# Altium project PCB_Project.PrjPcb
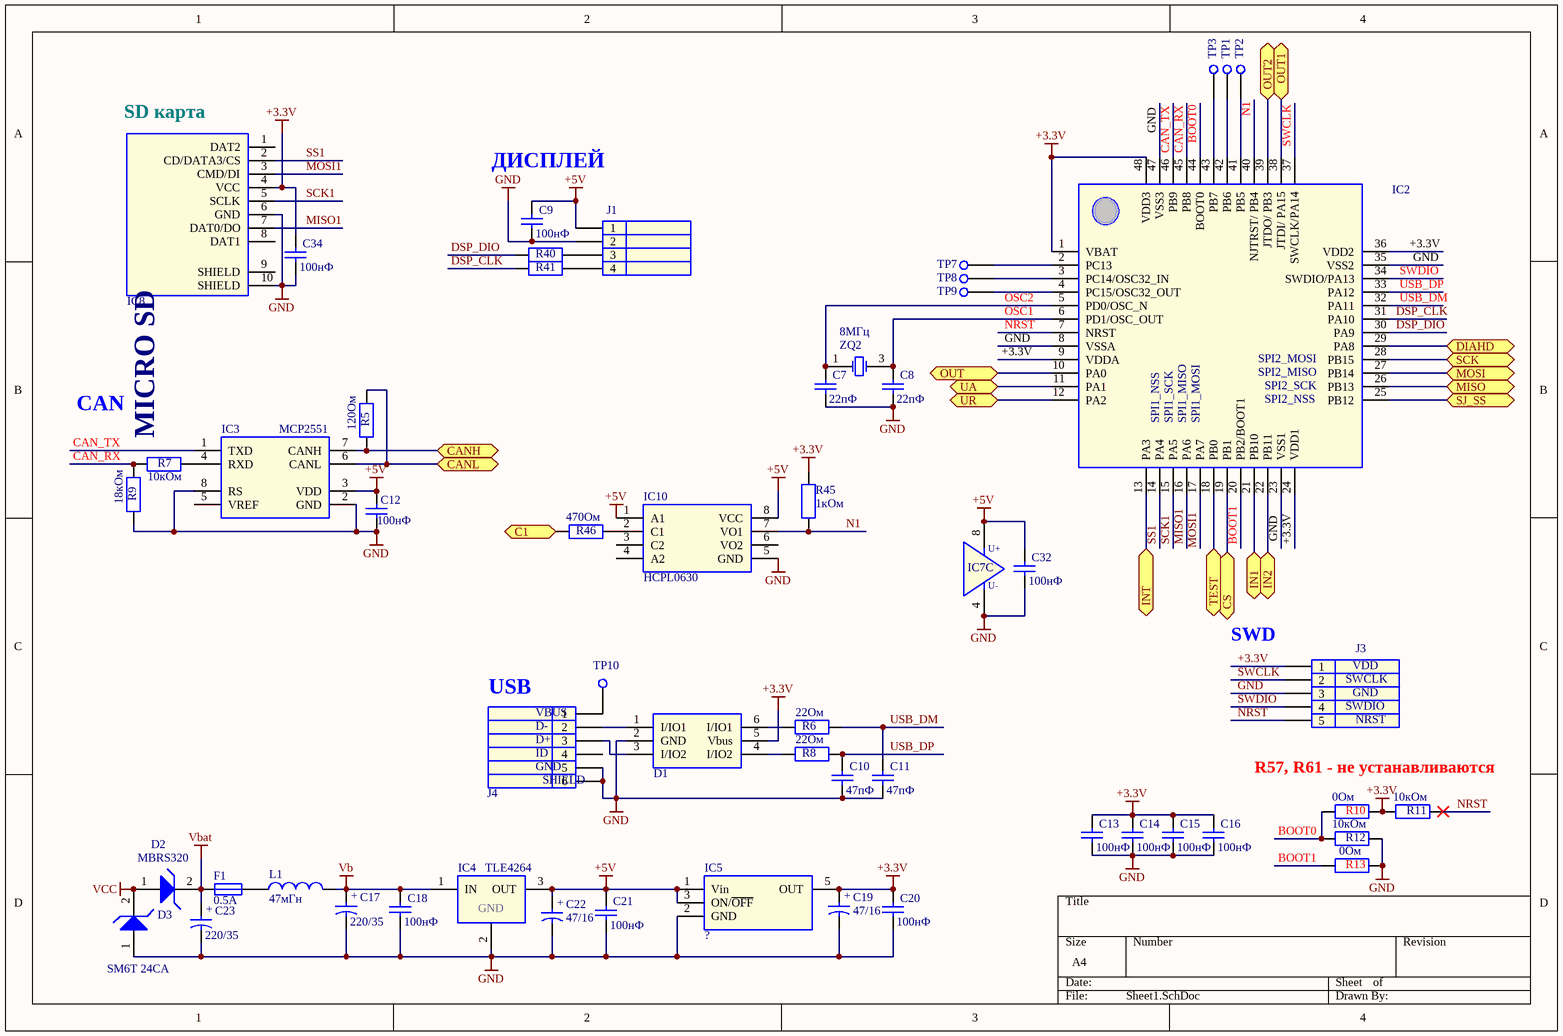
[diagram p0: Sheet1.SchDoc]
2 sheets, 112 parts. Net scope: flat (ports and power ports of the same name join across sheets).
Board file: PCB1.PcbDoc
Sheets:
  Sheet1.SchDoc
  Sheet2.SchDoc

## Sheet Sheet1.SchDoc
size A4

### Parts
C7  value 22пФ  [0603]  (hidden comment: Cap)
C8  value 22пФ  [0603]  (hidden comment: Cap)
C9  value 100нФ  [0603]  (hidden comment: Cap)
C10  value 47пФ  [0603]  (hidden comment: Cap)
C11  value 47пФ  [0603]  (hidden comment: Cap)
C12  value 100нФ  [0603]  (hidden comment: Cap)
C13  value 100нФ  [0603]  (hidden comment: Cap)
C14  value 100нФ  [0603]  (hidden comment: Cap)
C15  value 100нФ  [0603]  (hidden comment: Cap)
C16  value 100нФ  [0603]  (hidden comment: Cap)
C17  value 220/35  [SMD 8x10.5]  (hidden comment: Cap2)
C18  value 100нФ  [0603]  (hidden comment: Cap)
C19  value 47/16  [SMD 6.3x5.4]  (hidden comment: Cap2)
C20  value 100нФ  [0603]  (hidden comment: Cap)
C21  value 100нФ  [0603]  (hidden comment: Cap)
C22  value 47/16  [SMD 6.3x5.4]  (hidden comment: Cap2)
C23  value 220/35  [SMD 8x10.5]  (hidden comment: Cap2)
C32  value 100нФ  [0603]  (hidden comment: Cap)
C34  value 100нФ  [0603]  (hidden comment: Cap)
D1  USBLC6-2  [SOT23-6]  (value not drawn)
D2  value MBRS320  [DO-214AB]  (hidden comment: ZENER)
D3  value SM6T 24CA  [DO-214AA]  (hidden comment: ZENER)
F1  value 0.5A  [1812Fuse]  (hidden comment: FUSE)
IC2  STM32F10x_LQFP48  [LQFP48-0.5]  (value not drawn)
IC3  MCP2551  [SO-8]
IC4  value TLE4264  [SOT223]  (hidden comment: SOT223)
IC5  LP2980  [SOT23-5]  (value not drawn)
IC7  LM258  [SO-8]  (value not drawn)  (part C of 3)
IC8  MICRO_SD_SLOT  [MICRO SD CARD 2]  (value not drawn)
IC10  HCPL0630  [SO-8]
J1  s-4  [CWF-4R]  (value not drawn)
J3  s-5  [PLS-5]  (value not drawn)
J4  USB micro-BF  [USB micro B]  (value not drawn)
L1  value 47мГн  [LQH32C]  (hidden comment: Inductor)
R5  value 120Ом  [0603]  (hidden comment: Res)
R6  value 22Ом  [0603]  (hidden comment: Res)
R7  value 10кОм  [0603]  (hidden comment: Res)
R8  value 22Ом  [0603]  (hidden comment: Res)
R9  value 18кОм  [0603]  (hidden comment: Res)
R10  value 0Ом  [0603]  (hidden comment: Res)
R11  value 10кОм  [0603]  (hidden comment: Res)
R12  value 10кОм  [0603]  (hidden comment: Res)
R13  value 0Ом  [0603]  (hidden comment: Res)
R40  Res  [0603]  (value not drawn)
R41  Res  [0603]  (value not drawn)
R45  value 1кОм  [0603]  (hidden comment: Res)
R46  value 470Ом  [0603]  (hidden comment: Res)
TP1  TP  [PAD_R1]  (value not drawn)
TP2  TP  [PAD_R1]  (value not drawn)
TP3  TP  [PAD_R1]  (value not drawn)
TP7  TP  [PAD_R1]  (value not drawn)
TP8  TP  [PAD_R1]  (value not drawn)
TP9  TP  [PAD_R1]  (value not drawn)
TP10  TP  [PAD_R1]  (value not drawn)
ZQ2  value 8МГц  [KX-9A]  (hidden comment: QUARTZ_2)

### Ports
C1, CANH, CANL, CS, DIAHD, IN1, IN2, INT, MISO, MOSI, OUT, OUT1, OUT2, SCK, SJ_SS, TEST, UA, UR

### Nets
+3.3V: C13.2 C14.2 C15.2 C16.2 C19.1 C20.2 C34.2 D1.5(Vbus) IC2.1(VBAT) IC2.9(VDDA) IC2.24(VDD1) IC2.36(VDD2) IC2.48(VDD3) IC5.5(OUT) IC8.4(VCC) J3.1 R10.2 R11.1 R45.1
+5V: C9.2 C12.2 C21.2 C22.1 C32.2 IC3.3(VDD) IC4.3(OUT) IC5.1(Vin) IC5.3(ON/~{OFF}) IC7.8(+U) IC10.1(A1) IC10.8(VCC) J1.1
GND: C7.1 C8.1 C9.1 C10.1 C11.1 C12.1 C13.1 C14.1 C15.1 C16.1 C17.2 C18.1 C19.2 C20.1 C21.1 C22.2 C23.2 C32.1 C34.1 D1.2(GND) D3.1(A) IC2.8(VSSA) IC2.23(VSS1) IC2.35(VSS2) IC2.47(VSS3) IC3.2(GND) IC3.8(RS) IC4.2(GND) IC5.2(GND) IC7.4(U-) IC8.6(GND) IC8.10(SHIELD) IC10.5(GND) J1.2 J3.3 J4.5 J4.6 R9.1 R12.2 R13.2
Vb: C17.1 C18.2 IC4.1(IN) L1.2
Vbat: C23.1 D2.2(K) F1.1
VCC: D2.1(A) D3.2(K)
BOOT0: IC2.44(BOOT0) R10.1 R12.1
BOOT1: IC2.20(PB2/BOOT1) R13.1
CAN_RX: IC2.45(PB8) R7.1 R9.2
CAN_TX: IC2.46(PB9) IC3.1(TXD)
CS: IC2.19(PB1) ; port CS
DSP_CLK: IC2.31(PA10) R41.2
DSP_DIO: IC2.30(PA9) R40.2
INT: IC2.13(PA3) ; port INT
MISO: IC2.26(PB13) ; port MISO
MISO1: IC2.16(PA6) IC8.7(DAT0/DO)
MOSI: IC2.27(PB14) ; port MOSI
MOSI1: IC2.17(PA7) IC8.3(CMD/DI)
N1: IC2.40(NJTRST/_PB4) IC10.7(VO1) R45.2
NRST: IC2.7(NRST) J3.5 R11.2
OSC1: C8.2 IC2.6(PD1/OSC_OUT) ZQ2.3(OSC2)
OSC2: C7.2 IC2.5(PD0/OSC_N) ZQ2.1(OSC1)
SCK: IC2.28(PB15) ; port SCK
SCK1: IC2.15(PA5) IC8.5(SCLK)
SS1: IC2.14(PA4) IC8.2(CD/DATA3/CS)
SWCLK: IC2.37(SWCLK/PA14) J3.2
SWDIO: IC2.34(SWDIO/PA13) J3.4
TEST: IC2.18(PB0) ; port TEST
USB_DM: C11.2 IC2.32(PA11) R6.1
USB_DP: C10.2 IC2.33(PA12) R8.1
NetC29_1: IC2.12(PA2) ; port UR
NetC30_1: IC2.11(PA1) ; port UA
NetD1_1: D1.1(I/IO1) J4.2
NetD1_3: D1.3(I/IO2) J4.3
NetD1_4: D1.4(I/IO2) R8.2
NetD1_6: D1.6(I/IO1) R6.2
NetF1_2: F1.2 L1.1
NetIC2_2: IC2.2(PC13) TP7.1
NetIC2_3: IC2.3(PC14/OSC32_IN) TP8.1
NetIC2_4: IC2.4(PC15/OSC32_OUT) TP9.1
NetIC2_10: IC2.10(PA0) ; port OUT
NetIC2_21: IC2.21(PB10) ; port IN1
NetIC2_22: IC2.22(PB11) ; port IN2
NetIC2_25: IC2.25(PB12) ; port SJ_SS
NetIC2_29: IC2.29(PA8) ; port DIAHD
NetIC2_38: IC2.38(JTDI/_PA15) ; port OUT1
NetIC2_39: IC2.39(JTDO/_PB3) ; port OUT2
NetIC2_41: IC2.41(PB5) TP2.1
NetIC2_42: IC2.42(PB6) TP1.1
NetIC2_43: IC2.43(PB7) TP3.1
NetIC3_4: IC3.4(RXD) R7.2
NetIC3_6: IC3.6(CANL) R5.2 ; port CANL
NetIC3_7: IC3.7(CANH) R5.1 ; port CANH
NetIC10_2: IC10.2(C1) R46.1
NetJ1_3: J1.3 R40.1
NetJ1_4: J1.4 R41.1
NetJ4_1: J4.1 TP10.1
NetJ5_4: R46.2 ; port C1

Not connected (* = marked no-connect by the designer): IC3 5(VREF); IC8 1(DAT2) 8(DAT1) 9(SHIELD); IC10 3(C2) 4(A2) 6(VO2); J4 4

### Notes on the sheet
- (near IC8) SD карта
- ДИСПЛЕЙ
- (near IC2) SPI2_MOSI
- (near IC2) SPI2_MISO
- CAN
- (near IC2) SPI1_NSS
- (near IC2) SPI1_SCK
- (near IC2) SPI1_MISO
- (near IC2) SPI1_MOSI
- (near IC2) SPI2_SCK
- (near IC2) SPI2_NSS
- SWD
- USB
- (near J3) SWCLK
- (near J3) SWDIO
- (near J3) VDD
- (near J3) GND
- R57, R61 - не устанавливаются
- (near J3) NRST
- (in symbol Cap2) +
- (in symbol LM258, part C) U+
- (in symbol MICRO_SD_SLOT) MICRO SD
- (in symbol USB micro-BF) VBUS; D-; D+; ID; GND; SHIELD

### Library data of the parts
C7 C8 = Cap: Capacitor; Order: 22пФ 10% 50В 0805; Group: Конденсаторы; Function: Конденсатор неполярный; Manufacturer: ?; Case: ?
C9 C12-C16 C18 C20 C21 C32 C34 = Cap: Capacitor; Order: 100нФ 10% 50В 0805; Group: Конденсаторы; Function: Конденсатор неполярный; Manufacturer: ?; Case: ?
C10 C11 = Cap: Capacitor; Order: 47пФ 10% 50В 0805; Group: Конденсаторы; Function: Конденсатор неполярный; Manufacturer: ?; Case: ?
C17 C19 C22 C23 = Cap2: Capacitor; Group: Конденсаторы; Function: Конденсатор полярный; Manufacturer: ?
  C17 C23: Order: 220/35; Case: SMD 8x10.5
  C19 C22: Order: 47/16; Case: ?
D1 = USBLC6-2: Group: Диоды; Function: Very low capacitance ESD protection; Order: USBLC6-2; Value: USBLC6-2; Manufacturer: ?; Case: ?
D2 D3 = ZENER: Group: Диоды; Function: Zener диод; Manufacturer: ?
  D2: Order: MBRS320; Case: DO-214AB
  D3: Order: SM6T 24CA; Case: DO-214AA
F1 = FUSE: Resistor; Group: Разное; Order: 0.5A; Manufacturer: ?; Function: ?; Case: 1812Fuse
IC2 = STM32F10x_LQFP48: Manufactirer: STM; Group: Микросхемы; Function: MCU; Value: STM32F10x; Order: STM32F10x; Case: LQFP48-0.5
IC3 = MCP2551: Manufacturer: Microchip; Order: MCP2551T-I/SN; Function: CAN передатчик; Order: Микросхемы; Case: SO-8; Value: MCP2551
IC4 = TLE4264: Manufacturer: infineon; Group: Микросхемы; Function: Стабилизатор; Order: TLE4264; Case: SOT223
IC5 = LP2980: Order: LP2980IM5-3.3; Value: ?
IC7 = LM258: Manufacturer: Texas Instruments; Group: Микросхемы; Order: LM258D; Function: ОУ; Value: LM258; Case: SO-8
IC8 = MICRO_SD_SLOT: Value: micro SD; Group: Разъемы; Function: Разъем для microSD карт; Case: ?; Order: micro SD; Manufacturer: ?
IC10 = HCPL0630: Manufacturer: Fairchild Semiconductor; Function: Развязка с лог. выходом; Group: Микросхемы; Order: HCPL0630; Case: SO-8; Value: HCPL0630
J1 = s-4: Group: Разъемы; Order: CWF-4R; Value: ?; Manufacturer: ?; Function: ?; Case: ?
J4 = USB micro-BF: Value: USB micro B; Case: ?; Order: USB micro B
L1 = Inductor: Group: Индуктивности; Function: Индуктивность; Order: 47мГн; Case: LQH32C; Manufacturer: ?
R5 = Res: Resistor; Order: 120Ом 5% 0805; Group: Резисторы; Function: Резистор постоянный; Case: ?; Manufacturer: ?
R6 R8 = Res: Resistor; Order: 22Ом 5% 0805; Group: Резисторы; Function: Резистор постоянный; Case: ?; Manufacturer: ?
R7 R11 R12 = Res: Resistor; Order: 10кОм 5% 0805; Group: Резисторы; Function: Резистор постоянный; Case: ?; Manufacturer: ?
R9 = Res: Resistor; Order: 18кОм 5% 0805; Group: Резисторы; Function: Резистор постоянный; Case: ?; Manufacturer: ?
R10 R13 = Res: Resistor; Order: 0Ом 5% 0805; Group: Резисторы; Function: Резистор постоянный; Case: ?; Manufacturer: ?
R40 R41 = Res: Resistor; Order: 100Ом 5% 0805; Group: Резисторы; Function: Резистор постоянный; Value: 100Ом; Case: ?; Manufacturer: ?
R45 = Res: Resistor; Order: 1кОм 5% 0805; Group: Резисторы; Function: Резистор постоянный; Case: ?; Manufacturer: ?
R46 = Res: Resistor; Order: 470Ом 5% 0805; Group: Резисторы; Function: Резистор постоянный; Case: ?; Manufacturer: ?
TP1-TP3 TP7-TP10 = TP: Group: Не устанавливается; Value: tp; Order: tp; Manufactirer: ?; Function: ?; Case: ?
ZQ2 = KX-9A: Crystal Oscillator; Manufacturer: Кварцевый резонатор; Group: Резонаторы; Order: 8МГц; Case: KX-9A; Function: Crystal Oscillator
J3 = s-5: Order: PLS-5; Value: ?

## Sheet Sheet2.SchDoc
size A4
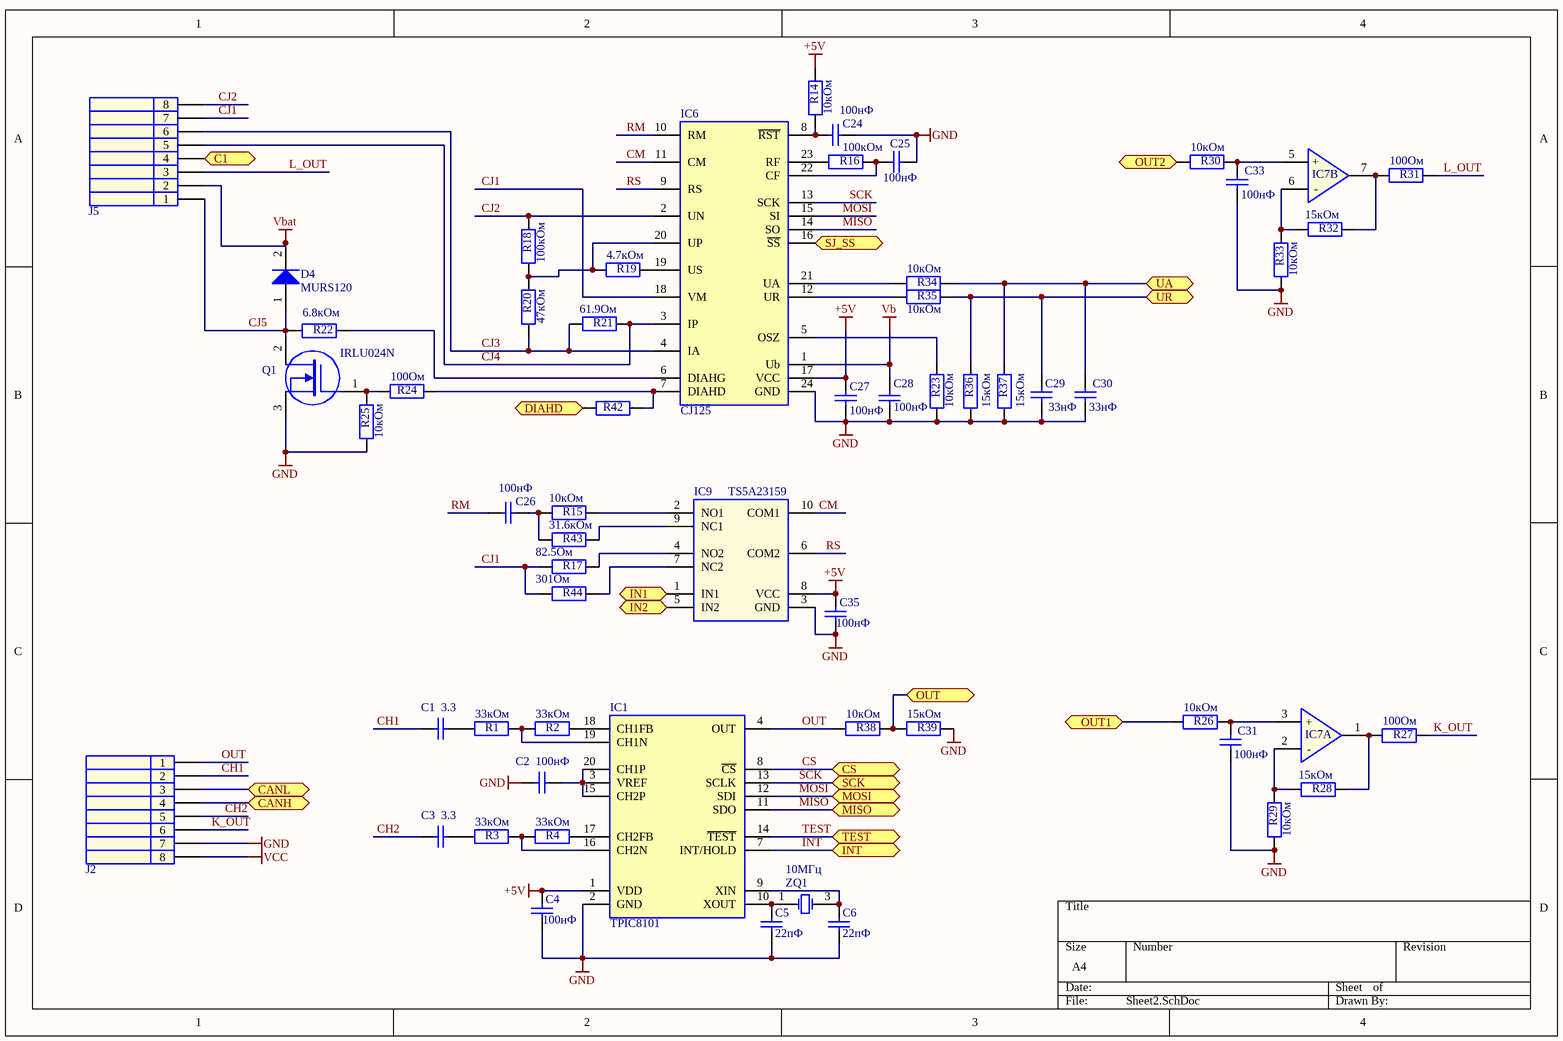
[diagram p1: Sheet2.SchDoc]

### Parts
C1  value 3.3  [0603]  (hidden comment: Cap)
C2  value 100нФ  [0603]  (hidden comment: Cap)
C3  value 3.3  [0603]  (hidden comment: Cap)
C4  value 100нФ  [0603]  (hidden comment: Cap)
C5  value 22пФ  [0603]  (hidden comment: Cap)
C6  value 22пФ  [0603]  (hidden comment: Cap)
C24  value 100нФ  [0603]  (hidden comment: Cap)
C25  value 100нФ  [0603]  (hidden comment: Cap)
C26  value 100нФ  [0603]  (hidden comment: Cap)
C27  value 100нФ  [0603]  (hidden comment: Cap)
C28  value 100нФ  [0603]  (hidden comment: Cap)
C29  value 33нФ  [0603]  (hidden comment: Cap)
C30  value 33нФ  [0603]  (hidden comment: Cap)
C31  value 100нФ  [0603]  (hidden comment: Cap)
C33  value 100нФ  [0603]  (hidden comment: Cap)
C35  value 100нФ  [0603]  (hidden comment: Cap)
D4  value MURS120  [DO-214AA]  (hidden comment: Diode)
IC1  TPIC8101  [SOL-20]
IC6  CJ125  [SOL24_1.27_11.4_7.4]
IC7  LM258  [SO-8]  (value not drawn)  (parts A,B of 3)
IC9  TS5A23159  [PUQFN-N10]
J2  s-8  [43045-0800-wo]  (value not drawn)
J5  s-8  [43045-0800-wo]  (value not drawn)
Q1  value IRLU024N  [TO-252]  (hidden comment: MOSFET_N_CH)
R1  value 33кОм  [0603]  (hidden comment: Res)
R2  value 33кОм  [0603]  (hidden comment: Res)
R3  value 33кОм  [0603]  (hidden comment: Res)
R4  value 33кОм  [0603]  (hidden comment: Res)
R14  value 10кОм  [0603]  (hidden comment: Res)
R15  value 10кОм  [0603]  (hidden comment: Res)
R16  value 100кОм  [0603]  (hidden comment: Res)
R17  value 82.5Ом  [0603]  (hidden comment: Res)
R18  value 100кОм  [0603]  (hidden comment: Res)
R19  value 4.7кОм  [0603]  (hidden comment: Res)
R20  value 47кОм  [0603]  (hidden comment: Res)
R21  value 61.9Ом  [0603]  (hidden comment: Res)
R22  value 6.8кОм  [0603]  (hidden comment: Res)
R23  value 10кОм  [0603]  (hidden comment: Res)
R24  value 100Ом  [0603]  (hidden comment: Res)
R25  value 10кОм  [0603]  (hidden comment: Res)
R26  value 10кОм  [0603]  (hidden comment: Res)
R27  value 100Ом  [0603]  (hidden comment: Res)
R28  value 15кОм  [0603]  (hidden comment: Res)
R29  value 10кОм  [0603]  (hidden comment: Res)
R30  value 10кОм  [0603]  (hidden comment: Res)
R31  value 100Ом  [0603]  (hidden comment: Res)
R32  value 15кОм  [0603]  (hidden comment: Res)
R33  value 10кОм  [0603]  (hidden comment: Res)
R34  value 10кОм  [0603]  (hidden comment: Res)
R35  value 10кОм  [0603]  (hidden comment: Res)
R36  value 15кОм  [0603]  (hidden comment: Res)
R37  value 15кОм  [0603]  (hidden comment: Res)
R38  value 10кОм  [0603]  (hidden comment: Res)
R39  value 15кОм  [0603]  (hidden comment: Res)
R42  Res  [0603]  (value not drawn)
R43  value 31.6кОм  [0603]  (hidden comment: Res)
R44  value 301Ом  [0603]  (hidden comment: Res)
ZQ1  value 10МГц  [KX-9A]  (hidden comment: QUARTZ_2)

### Ports
C1, CANH, CANL, CS, DIAHD, IN1, IN2, INT, MISO, MOSI, OUT, OUT1, OUT2, SCK, SJ_SS, TEST, UA, UR

### Nets
+5V: C4.2 C27.1 C35.2 IC1.1(VDD) IC6.17(VCC) IC9.8(VCC) R14.2
GND: C2.1 C4.1 C5.1 C6.1 C24.1 C25.1 C27.2 C28.2 C29.2 C30.2 C31.1 C33.1 C35.1 IC1.2(GND) IC6.24(GND) IC9.3(GND) J2.7 Q1.3(S) R23.1 R25.1 R29.1 R33.1 R36.2 R37.2 R39.1
Vb: C28.1 IC6.1(Ub)
Vbat: D4.2(K) J5.2
VCC: J2.8
CH1: C1.1 J2.2
CH2: C3.1 J2.5
CJ1: IC6.18(VM) J5.7 R17.1 R44.1
CJ2: IC6.2(UN) J5.8 R18.2
CJ3: IC6.4(IA) J5.6 R20.1 R21.1
CJ4: IC6.3(IP) J5.5 R21.2
CJ5: D4.1(A) J5.1 Q1.2(D) R22.2
CM: IC6.11(CM) IC9.10(COM1)
CS: IC1.8(~{CS}) ; port CS
INT: IC1.7(INT/HOLD) ; port INT
K_OUT: J2.6 R27.1
L_OUT: J5.3 R31.1
MISO: IC1.11(SDO) IC6.14(SO) ; port MISO
MOSI: IC1.12(SDI) IC6.15(SI) ; port MOSI
OUT: IC1.4(OUT) J2.1 R38.2
RM: C26.2 IC6.10(RM)
RS: IC6.9(RS) IC9.6(COM2)
SCK: IC1.13(SCLK) IC6.13(SCK) ; port SCK
TEST: IC1.14(~{TEST}) ; port TEST
NetC1_2: C1.2 R1.1
NetC2_2: C2.2 IC1.3(VREF) IC1.15(CH2P) IC1.20(CH1P)
NetC3_2: C3.2 R3.1
NetC5_2: C5.2 IC1.10(XOUT) ZQ1.1(OSC1)
NetC6_2: C6.2 IC1.9(XIN) ZQ1.3(OSC2)
NetC24_2: C24.2 IC6.8(~{RST}) R14.1
NetC25_2: C25.2 IC6.22(CF) R16.1
NetC26_1: C26.1 R15.1 R43.1
NetC29_1: C29.1 R35.1 R36.1 ; port UR
NetC30_1: C30.1 R34.1 R37.1 ; port UA
NetC31_2: C31.2 IC7.3(+) R26.1
NetC33_2: C33.2 IC7.5(+) R30.1
NetIC1_16: IC1.16(CH2N) R3.2 R4.1
NetIC1_17: IC1.17(CH2FB) R4.2
NetIC1_18: IC1.18(CH1FB) R2.2
NetIC1_19: IC1.19(CH1N) R1.2 R2.1
NetIC2_10: R38.1 R39.2 ; port OUT
NetIC2_21: IC9.1(IN1) ; port IN1
NetIC2_22: IC9.5(IN2) ; port IN2
NetIC2_25: IC6.16(~{SS}) ; port SJ_SS
NetIC2_29: R42.2 ; port DIAHD
NetIC2_38: R26.2 ; port OUT1
NetIC2_39: R30.2 ; port OUT2
NetIC3_6: J2.3 ; port CANL
NetIC3_7: J2.4 ; port CANH
NetIC6_5: IC6.5(OSZ) R23.2
NetIC6_6: IC6.6(DIAHG) R22.1
NetIC6_7: IC6.7(DIAHD) R24.1 R42.1
NetIC6_12: IC6.12(UR) R35.2
NetIC6_19: IC6.19(US) R19.2
NetIC6_20: IC6.20(UP) R18.1 R19.1 R20.2
NetIC6_21: IC6.21(UA) R34.2
NetIC6_23: IC6.23(RF) R16.2
NetIC7_1: IC7.1(OUT) R27.2 R28.2
NetIC7_2: IC7.2(-) R28.1 R29.2
NetIC7_6: IC7.6(-) R32.1 R33.2
NetIC7_7: IC7.7(OUT) R31.2 R32.2
NetIC9_2: IC9.2(NO1) R15.2
NetIC9_4: IC9.4(NO2) R17.2
NetIC9_7: IC9.7(NC2) R44.2
NetIC9_9: IC9.9(NC1) R43.2
NetJ5_4: J5.4 ; port C1
NetQ1_1: Q1.1(G) R24.2 R25.2

### Library data of the parts
C1 C3 = Cap: Capacitor; Order: 3.3нФ 10% 50В 0805; Group: Конденсаторы; Function: Конденсатор неполярный; Manufacturer: ?; Case: 0805
C2 C4 C24-C28 C31 C33 C35 = Cap: as C9 on sheet Sheet1; Manufacturer: ?
  C2 C4 C35: Case: 0805
  C24-C28 C31 C33: Case: ?
C5 C6 = Cap: as C7 on sheet Sheet1; Manufacturer: ?; Case: 0805
C29 C30 = Cap: Capacitor; Order: 33нФ 10% 50В 0805; Group: Конденсаторы; Function: Конденсатор неполярный; Manufacturer: ?; Case: ?
D4 = Diode: Group: Диоды; Function: Диод выпрямительный; Order: MURS120; manufacturer: ?; Case: DO-214AA
IC1 = TPIC8101: Manufacturer: Texas Instruments; Group: Микросхемы; Function: Knock Sensor Interface; Case: SOIC-20; Order: TPIC8101; Value: TPIC8101
IC6 = CJ125: Manufacturer: infinion; Group: Микросхемы; Function: Lambda Probe Interface; Case: ?; Order: CJ125; Value: CJ125
IC7 = LM258: as IC7 on sheet Sheet1; Value: LM258; Case: SO-8
IC9 = TS5A23159: Manufacturer: Texas Instruments; Function: 1-Ω 2-Channel SPDT Analog Switch; Group: Микросхемы; Order: PUQFN-N10; Case: TS5A23159; Value: TS5A23159
J2 J5 = s-8: Order: 43045-0800; Group: Разъемы; Function: Разъем; Value: ?; Case: ?; Manufacturer: ?
Q1 = MOSFET_N_CH: Group: Транзисторы; Order: IRLU024N; Case: TO-252; Manufacturer: ?; Function: ?
R1-R4 = Res: Resistor; Order: 33кОм 5% 0805; Group: Резисторы; Function: Резистор постоянный; Case: 0805; Manufacturer: ?
R14 R15 R23 R25 R26 R29 R30 R33-R35 R38 = Res: as R7 on sheet Sheet1; Manufacturer: ?
  R14 R23 R25: Case: 0805
  R15 R26 R29 R30 R33-R35 R38: Case: ?
R16 R18 = Res: Resistor; Order: 100кОм 5% 0805; Group: Резисторы; Function: Резистор постоянный; Case: 0805; Manufacturer: ?
R17 R19 = Res: Resistor; Order: 82.5Ом 5% 0805; Group: Резисторы; Function: Резистор постоянный; Case: 0805; Manufacturer: ?
R20 = Res: Resistor; Order: 47кОм 5% 0805; Group: Резисторы; Function: Резистор постоянный; Case: 0805; Manufacturer: ?
R21 = Res: Resistor; Order: 61,9Ом 5% 0805; Group: Резисторы; Function: Резистор постоянный; Case: 0805; Manufacturer: ?
R22 = Res: Resistor; Order: 6.8кОм 5% 0805; Group: Резисторы; Function: Резистор постоянный; Case: 0805; Manufacturer: ?
R24 R27 R31 = Res: Resistor; Order: 100Ом 5% 0805; Group: Резисторы; Function: Резистор постоянный; Manufacturer: ?
  R24: Case: 0805
  R27 R31: Case: ?
R28 R32 R36 R37 R39 = Res: Resistor; Order: 15кОм 5% 0805; Group: Резисторы; Function: Резистор постоянный; Case: ?; Manufacturer: ?
R42 = Res: as R40 on sheet Sheet1; Case: ?; Manufacturer: ?
R43 = Res: Resistor; Order: 31.6кОм 5% 0805; Group: Резисторы; Function: Резистор постоянный; Case: ?; Manufacturer: ?
R44 = Res: Resistor; Order: 301Ом 5% 0805; Group: Резисторы; Function: Резистор постоянный; Case: 0805; Manufacturer: ?
ZQ1 = KX-9A: as ZQ2 on sheet Sheet1; Order: 10МГц; Case: KX-9A; Function: Crystal Oscillator

## Nets that join several sheets
+5V: Sheet1 (13 pins), Sheet2 (7 pins)
GND: Sheet1 (40 pins), Sheet2 (25 pins)
Vb: Sheet1 (C17.1 C18.2 IC4.1 L1.2), Sheet2 (C28.1 IC6.1)
Vbat: Sheet1 (C23.1 D2.2 F1.1), Sheet2 (D4.2 J5.2)
VCC: Sheet1 (D2.1 D3.2), Sheet2 (J2.8)
CS: Sheet1 (IC2.19), Sheet2 (IC1.8)
INT: Sheet1 (IC2.13), Sheet2 (IC1.7)
MISO: Sheet1 (IC2.26), Sheet2 (IC1.11 IC6.14)
MOSI: Sheet1 (IC2.27), Sheet2 (IC1.12 IC6.15)
NetC29_1: Sheet1 (IC2.12), Sheet2 (C29.1 R35.1 R36.1)
NetC30_1: Sheet1 (IC2.11), Sheet2 (C30.1 R34.1 R37.1)
NetIC2_10: Sheet1 (IC2.10), Sheet2 (R38.1 R39.2)
NetIC2_21: Sheet1 (IC2.21), Sheet2 (IC9.1)
NetIC2_22: Sheet1 (IC2.22), Sheet2 (IC9.5)
NetIC2_25: Sheet1 (IC2.25), Sheet2 (IC6.16)
NetIC2_29: Sheet1 (IC2.29), Sheet2 (R42.2)
NetIC2_38: Sheet1 (IC2.38), Sheet2 (R26.2)
NetIC2_39: Sheet1 (IC2.39), Sheet2 (R30.2)
NetIC3_6: Sheet1 (IC3.6 R5.2), Sheet2 (J2.3)
NetIC3_7: Sheet1 (IC3.7 R5.1), Sheet2 (J2.4)
NetJ5_4: Sheet1 (R46.2), Sheet2 (J5.4)
SCK: Sheet1 (IC2.28), Sheet2 (IC1.13 IC6.13)
TEST: Sheet1 (IC2.18), Sheet2 (IC1.14)